# EAGLE design working (EAGLE 9.3.2)
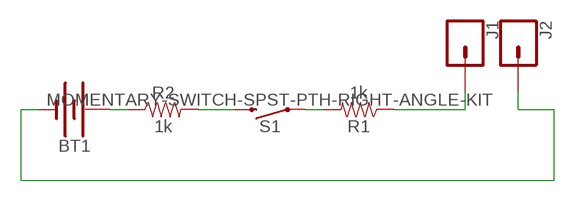
[diagram p0: schematic, sheet 1]

## Parts
BT1  BATTERY-20MM_SMD_4LEGS  [BATTCON_20MM_4LEGS]
J1  CONN_01  [1X01]
J2  CONN_01  [1X01]
R1  1k  1KOHM-HORIZ-1/4W-1%  [AXIAL-0.3]
R2  1k  1KOHM-HORIZ-1/4W-1%  [AXIAL-0.3]
S1  MOMENTARY-SWITCH-SPST-PTH-RIGHT-ANGLE-KIT  [TACTILE_SWITCH_PTH_RIGHT_ANGLE_KIT]

## Nets
N$1: R2.P$2 S1.2
N$2: R1.P$2 S1.1
N$3: J1.1 R1.P$1
N$4: BT1.NEGATIVE(-) J2.1
N$5: BT1.POSITIVE@1(+) BT1.POSITIVE@2(+) BT1.POSITIVE@3(+) BT1.POSITIVE@4(+) R2.P$1

## Library data of the parts
BT1 = SparkFun-Batteries:BATTERY: Battery - Single Cell A variety of battery chemistries, sizes, and footprints. Device List: 20MM_PTH - Coin Cell Battery Holder - 20mm (PTH) 20MM_PTH_KIT- Coin Cell battery Holder - 20 mm (PTH) kit version with special mask 6.8MM_PTH - Coin Cell Battery Holder - 6.8MM(SMD) 12MM_SMD - Coin Cell Battery Holder - 12mm (SMD) 12MM_PTH - Coin Cell Battery Holder - 12mm (PTH) 20MM_SMD - 20mm Coin Cell Battery Holder (SMD) (2 legs) Used on the Big Time Watch Kit 20MM_SMD_4LEGS - Coin Cell Battery Holder - 20mm (SMD) 20MM_SMD_4LEGS_OVERPASTE - Coin Cell Battery Holder - 20mm (SMD) (Over-paste on the legs) 24.5MM_PTH - Coin Cell Battery Holder - 24.5mm (PTH) 9V - 9V Battery Holder - PC Mount Used on the SparkFun SparkPunk Sound Kit and SparkFun SparkPunk Sequencer Kit 18650 - Battery Holder - 18650 (PTH) AA - Battery Holder - 1xAA (PTH) AAA - Battery Holder - 1xAAA (PTH) AA_KIT - Battery Holder - 1xAA (PTH) Special kit package - pads only have exposed copper on one side of the board. AAA_KIT - Battery Holder - 1xAAA (PTH) Special kit package - pads only have exposed copper on one side of the board.; PROD_ID: BATT-10373; SF_SKU: PRT-11892
J1 J2 = SparkFun-Connectors:CONN_01: Single connection point. Often used as Generic Header-pin footprint for 0.1 inch spaced/style header connections On any of the 0.1 inch spaced packages, you can populate with these: Break Away Headers - Straight (PRT-00116) Break Away Male Headers - Right Angle (PRT-00553) Female Headers (PRT-00115) Break Away Headers - Machine Pin (PRT-00117) Break Away Female Headers - Swiss Machine Pin (PRT-00743) This device is also useful as a general connection point to wire up your design to another part of your project. Our various solder wires solder well into these plated through hole pads. Hook-Up Wire - Assortment (Stranded, 22 AWG) (PRT-11375) Hook-Up Wire - Assortment (Solid Core, 22 AWG) (PRT-11367) View the entire wire category on our website here Special notes: SMTSO-256-ET is a "flush mount" nut for a 4-40 screw. We mostly use this on specialty testbeds; it is a nice way to connect hardware to your PCB at an adjustable hieght. Also note, the SNAP packages are for using a snappable style connector. We sell a baggie of snaps and they are also used on two LilyPad designs: Snap Assortment - 30 pack (male and female) (DEV-11347) LilyPad Arduino SimpleSnap (DEV-10941) LilyPad SimpleSnap Protoboard (DEV-10940)
R1 R2 = SparkFun-Resistors:1KOHM: 1kΩ resistor A resistor is a passive two-terminal electrical component that implements electrical resistance as a circuit element. Resistors act to reduce current flow, and, at the same time, act to lower voltage levels within circuits. - Wikipedia; PROD_ID: RES-12182
S1 = SparkFun-Switches:MOMENTARY-SWITCH-SPST: Momentary Switch (Pushbutton) - SPST Normally-open (NO) SPST momentary switches (buttons, pushbuttons). Variants PTH-12MM - 12mm square, through-hole Momentary Pushbutton Switch - 12mm Square (COM-09190) PTH-6.0MM, PTH-6.0MM-KIT - 6.0mm square, through-hole Mini Pushbutton Switch (COM-00097) KIT package intended for soldering kit's - only one side of pads' copper is exposed. PTH-RIGHT-ANGLE-KIT - Right-angle, through-hole Right Angle Tactile Button - Used on SparkFun BigTime Watch Kit SMD-12MM - 12mm square, surface-mount Tactile Button - SMD (12mm) (COM-12993) Used on SparkFun PicoBoard SMD-4.5MM - 4.5mm Square Trackball Switch Used on SparkFun Blackberry Trackballer Breakout SMD-4.6MMX2.8MM - 4.60mm x 2.80mm, surface mount Used on SparkFun SAMD21 Mini Breakout SMD-5.2MM, SMD-5.2-REDUNDANT - 5.2mm square, surface-mount Mini Pushbutton Switch - SMD (COM-08720) Used on Arduino Pro Mini REDUNDANT package connects both switch circuits together SMD-6.0X3.5MM - 6.0 x 3.5mm, surface mount Momentary Reset Switch SMD (COM-08229) SMD-6.2MM-TALL - 6.2mm square, surface mount Tactile Button - SMD (6mm) Used on SparkFun Digital Sandbox SMD-RIGHT-ANGLE - Right-angle, surface mount Used on SparkFun Block for Intel® Edison - Arduino; PROD_ID: CONN-10672; SF_SKU: COM-10791

## Board
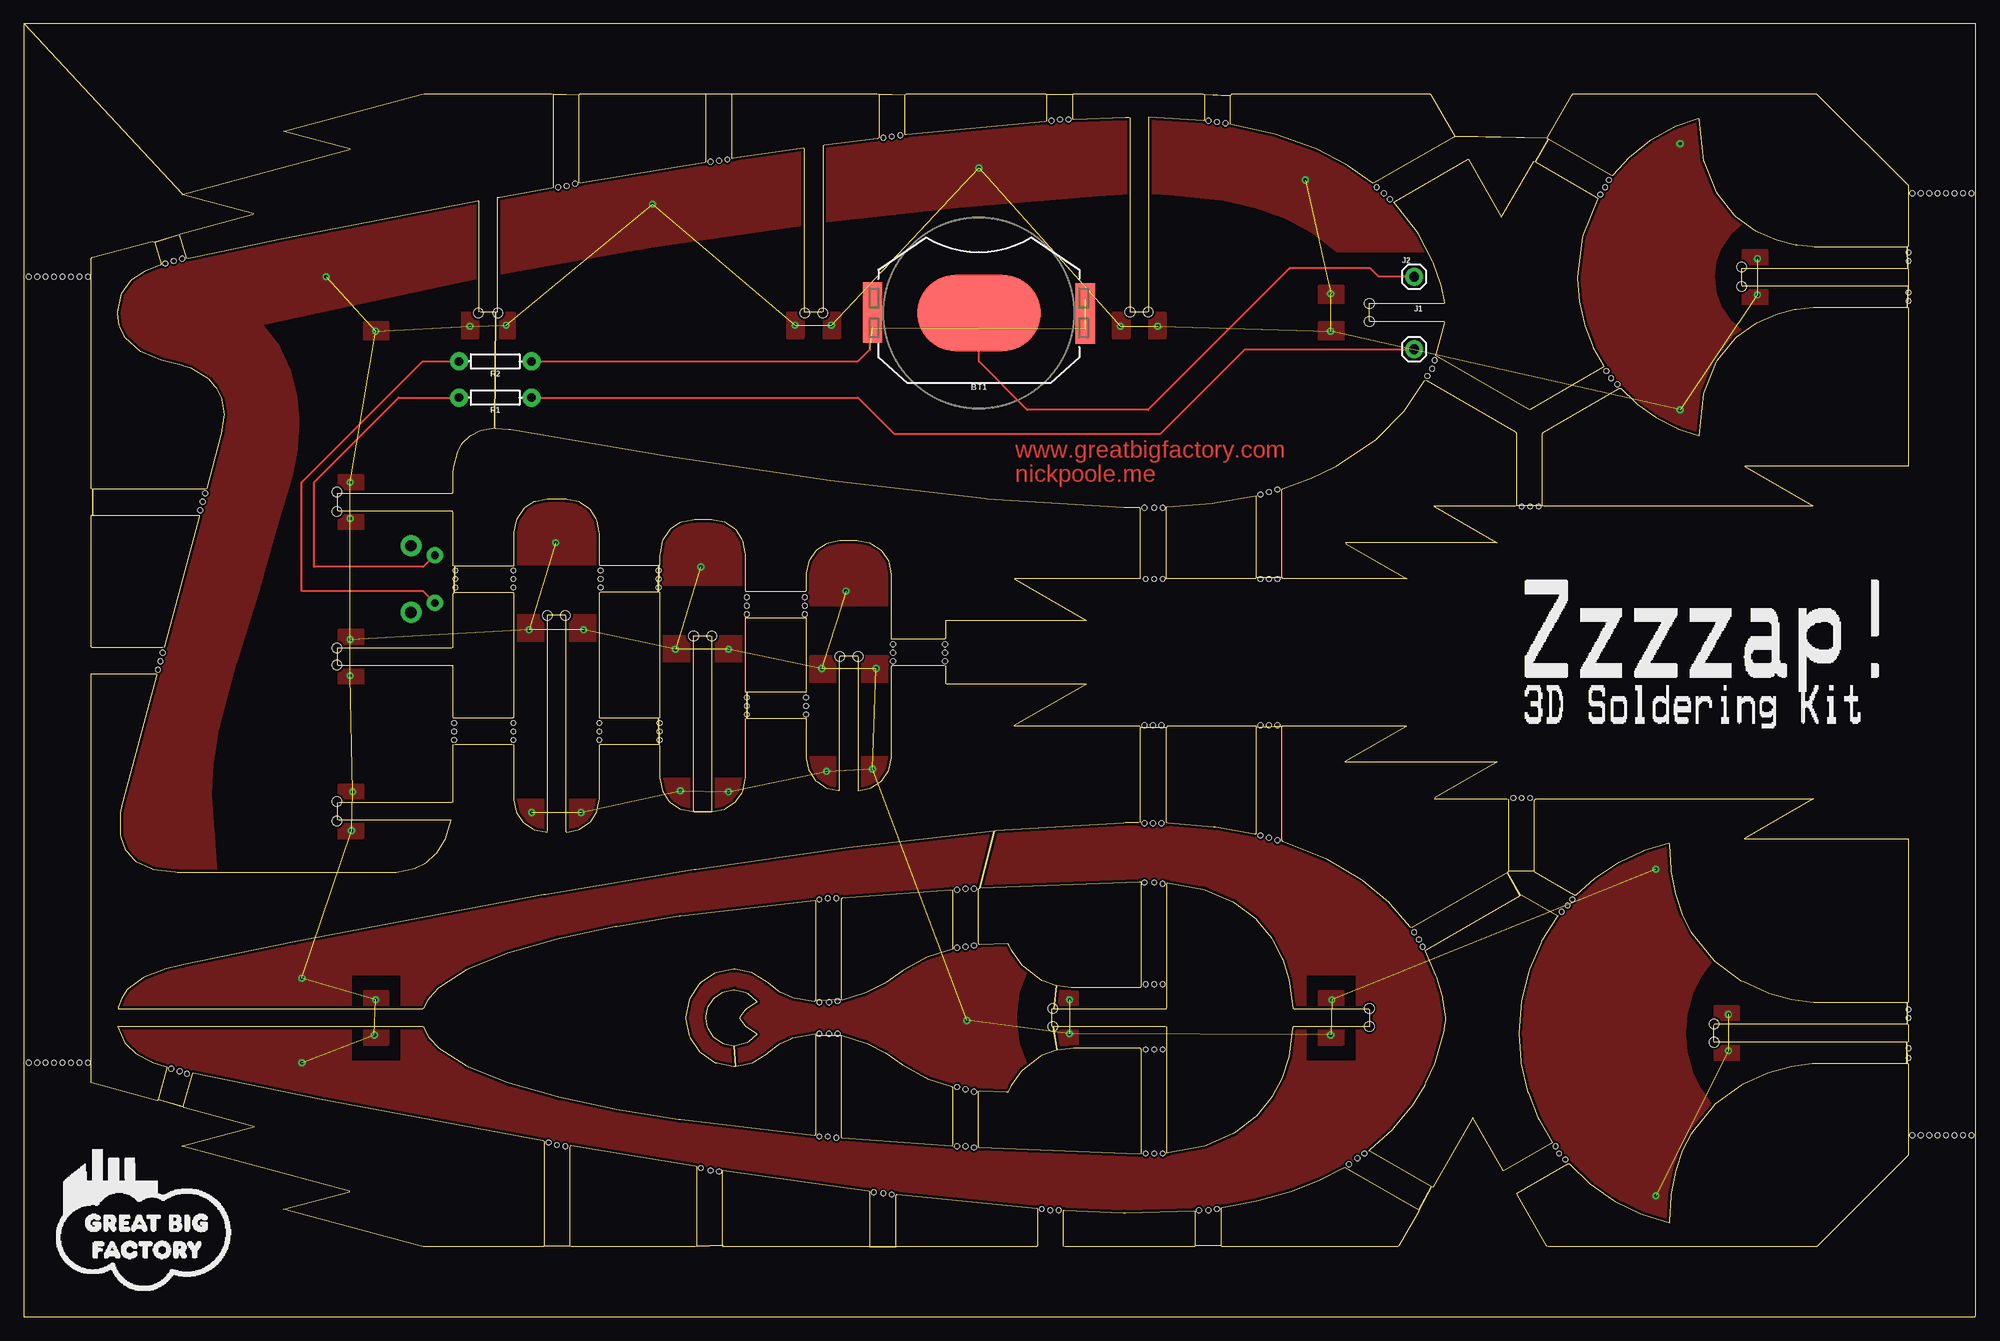
[diagram p1: board, top side]
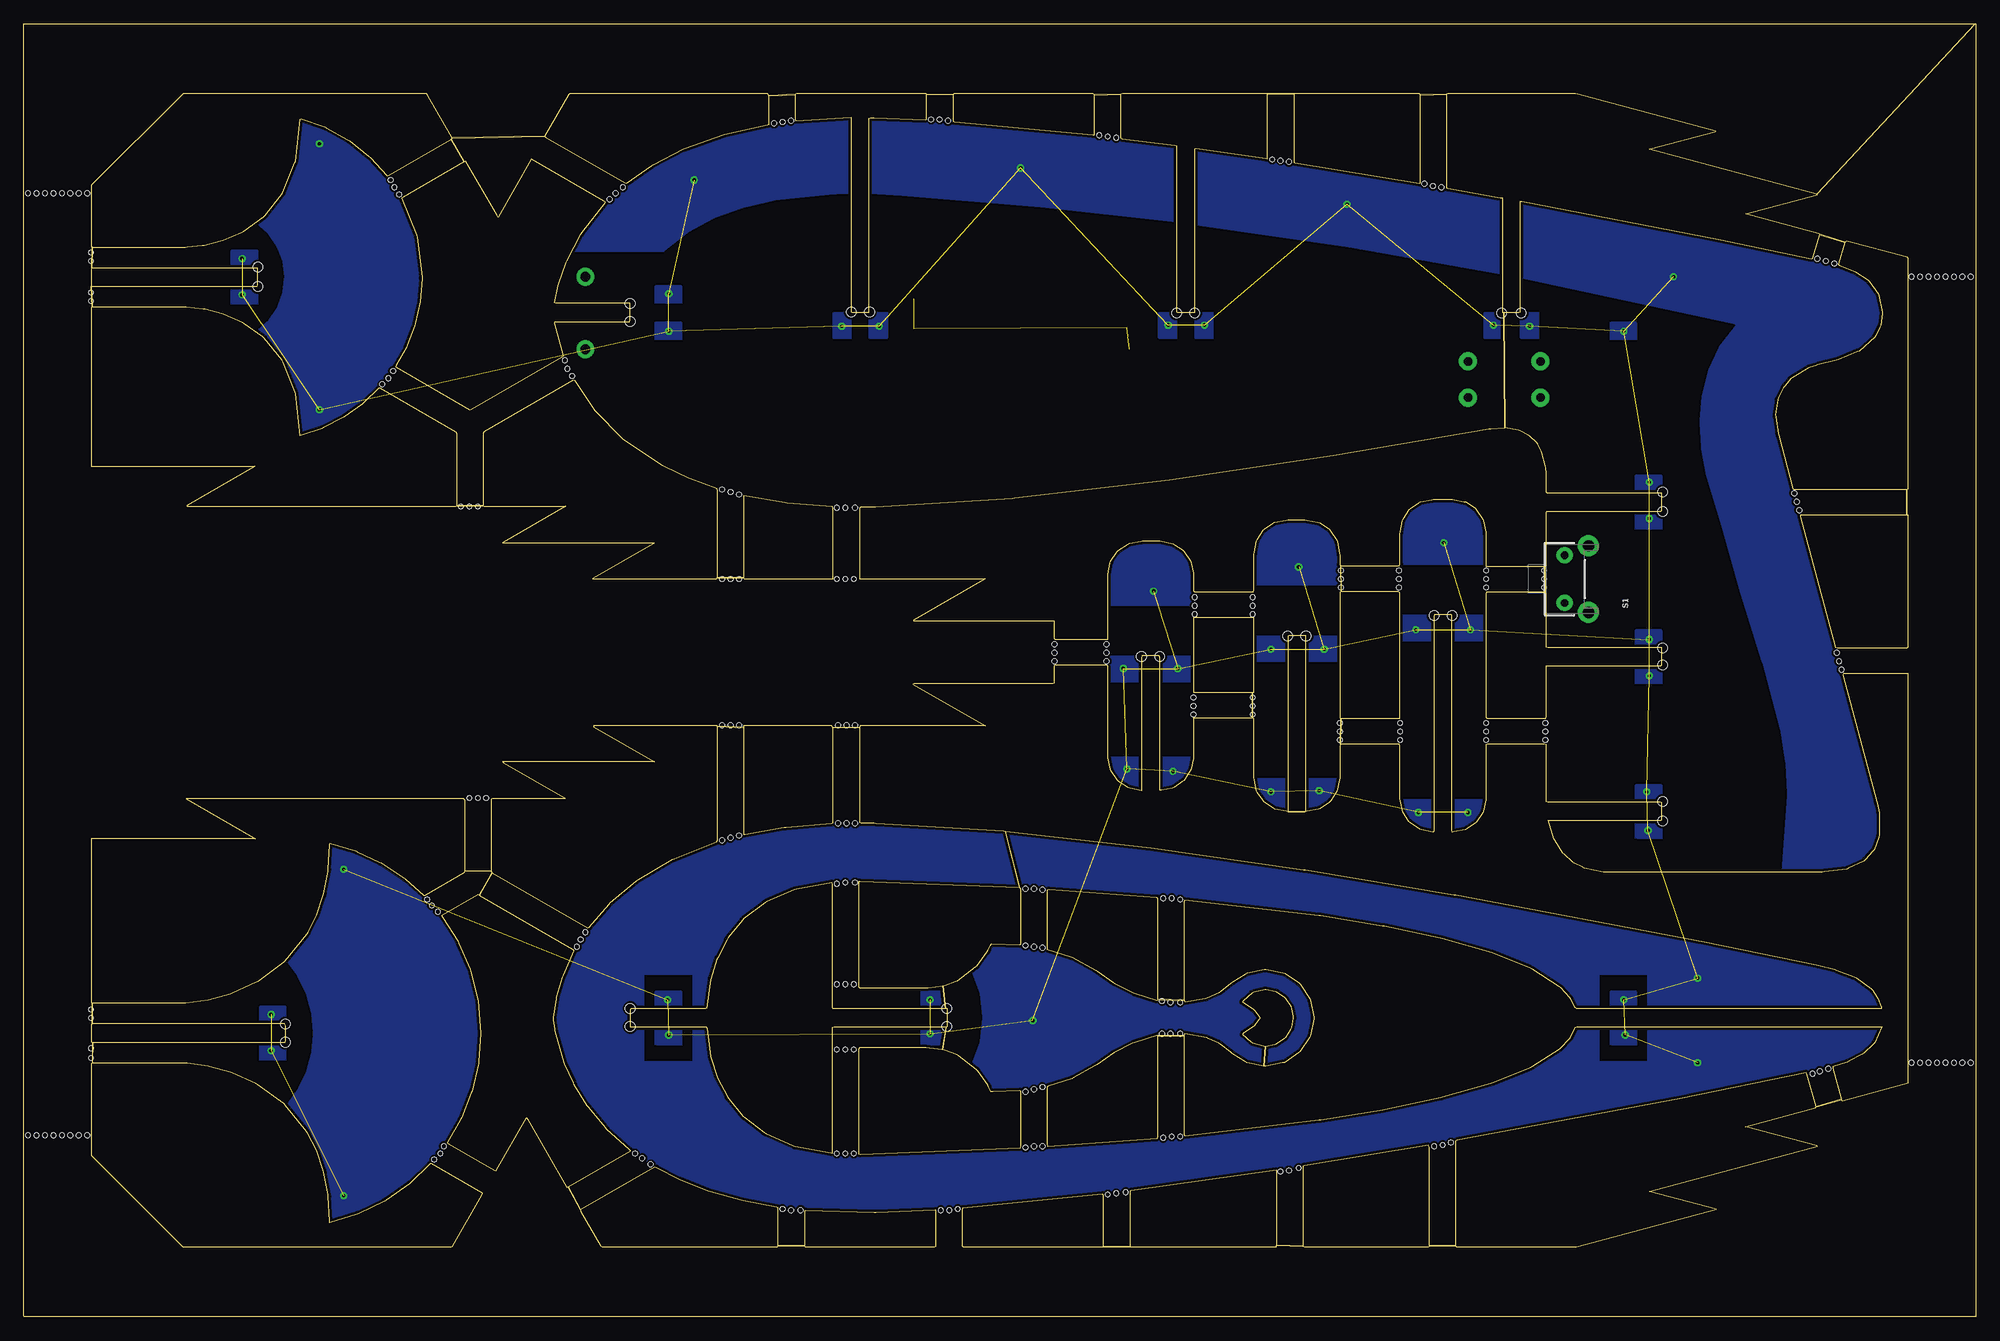
[diagram p2: board, bottom side, seen from below]

Size 205.04 x 135.78 mm. Coordinates in mm from the lower left corner, seen from the top.
Outline: 1141 segments
Copper layers (1*16): Top 0.035mm / dielectric 1.5mm / Bottom 0.035mm
Design rules "default *": minimum track width 6mil, minimum drill 0.35mm, track to track 6mil, track to pad 6mil, pad to pad 6mil, via to via 6mil, smd to smd 6mil, copper to edge 10mil, drill to drill 6mil, minimum pad ring 10mil, minimum via ring 8mil, stop-mask expansion 4mil, vias tented up to drill 0mil, thermal gap 10mil
Holes 0.51 mm at 14.86,110.62 15.75,110.87 16.64,111.13 19.05,86.49 18.8,85.6 18.54,84.71 14.61,69.72 14.35,68.83 14.1,67.95 45.34,78.36 45.34,77.47 45.34,76.58 45.21,62.36 45.21,61.47 45.21,60.58 117.73,84.96 118.75,84.96 119.63,84.96 129.92,86.36 131.7,86.87 130.81,86.61 147.45,98.81 148.21,100.46 147.96,99.57 142.11,118.62 143.51,117.35 142.88,117.98 124.46,125.6 126.24,125.35 125.35,125.48 107.95,125.6 109.73,125.73 108.84,125.73 92.08,124.08 90.3,123.83 91.19,123.95 73.91,121.54 72.14,121.29 73.03,121.41 57.91,119 56.13,118.62 57.02,118.75 51.44,78.36 51.44,77.47 51.44,76.58 51.44,62.36 51.44,61.47 51.44,60.58 60.58,78.36 60.58,77.47 60.58,76.58 66.68,78.36 66.68,77.47 66.68,76.58 60.45,62.36 60.45,61.47 60.45,60.58 66.8,62.36 66.8,61.47 66.8,60.58 75.95,75.57 75.95,74.68 75.95,73.79 82.04,75.57 82.04,74.68 82.04,73.79 75.95,65.02 75.95,64.14 75.95,63.25 82.17,65.02 82.17,64.14 82.17,63.25 91.31,70.61 91.31,69.72 91.31,68.83 96.77,70.61 96.77,69.72 96.77,68.83 117.86,77.47 118.75,77.47 119.63,77.47 129.92,77.47 130.81,77.47 131.7,77.47 157.35,85.09 158.24,85.09 159.13,85.09 117.73,62.1 118.62,62.1 119.51,62.1 129.92,62.1 130.81,62.1 131.7,62.1 156.46,54.48 157.35,54.48 158.24,54.48 165.61,117.86 166.5,119.38 166.12,118.62 167.39,97.92 166.24,99.31 166.75,98.55 197.99,110.87 197.99,111.76 197.99,107.57 197.99,106.68 197.99,32.26 197.99,31.37 197.99,28.19 197.99,27.18 162.69,43.82 161.54,42.55 162.18,43.18 160.91,17.91 161.93,16.51 161.29,17.15 117.86,28.07 118.75,28.07 119.63,28.07 146.94,38.86 146.05,40.39 146.56,39.62 140.84,17.15 139.19,16 140.08,16.64 117.86,17.15 119.63,17.15 118.75,17.15 117.73,45.59 119.63,45.47 118.75,45.59 129.92,50.55 131.7,50.04 130.81,50.29 117.73,51.82 119.51,51.82 118.62,51.82 15.49,26.04 17.15,25.53 16.38,25.78 125.35,11.3 123.44,11.18 124.46,11.18 106.93,11.3 108.71,11.18 107.82,11.18 98.04,17.91 99.82,17.78 98.93,17.91 85.34,18.8 83.57,18.92 84.46,18.92 99.82,23.62 98.04,24.13 98.93,23.88 83.57,29.72 85.47,29.72 84.58,29.72 98.04,38.74 99.82,38.99 98.93,38.86 83.57,33.02 85.47,33.15 84.58,33.02 98.04,44.83 99.82,44.96 98.93,44.96 83.57,43.82 85.34,43.94 84.46,43.94 89.28,13.08 91.19,12.83 90.3,12.95 71.12,15.62 73.03,15.24 72.14,15.37 55.12,18.29 56.9,17.91 56.01,18.03 0.51,109.22 1.4,109.22 2.29,109.22 3.18,109.22 4.06,109.22 4.95,109.22 5.84,109.22 6.73,109.22 0.51,26.67 1.4,26.67 2.29,26.67 3.18,26.67 4.06,26.67 4.95,26.67 5.84,26.67 6.73,26.67 198.37,117.98 199.26,117.98 200.15,117.98 201.04,117.98 201.93,117.98 202.82,117.98 203.71,117.98 204.6,117.98 198.37,19.05 199.26,19.05 200.15,19.05 201.04,19.05 201.93,19.05 202.82,19.05 203.71,19.05 204.6,19.05 117.86,34.93 118.75,34.93 119.63,34.93
Holes 1.02 mm at 141.35,30.48 141.35,32.39 177.55,28.83 177.55,30.73 108.08,32.39 108.08,30.48 87.63,69.34 85.73,69.34 72.26,71.5 70.36,71.5 56.9,73.66 54.99,73.66 32.89,70.23 32.89,68.45 32.89,52.07 32.89,54.1 32.89,86.61 32.89,84.58 47.75,105.41 49.78,105.41 83.95,105.41 82.04,105.41 116.21,105.54 118.11,105.54 141.35,106.43 141.35,104.52 180.47,110.24 180.47,108.2

### Footprints (pad centres in the part's own frame; a part is rotated, then mirrored left to right if it is on the bottom)
BATTCON_20MM_4LEGS = smd 13 x 8: NEGATIVE 0,0 | smd 2.032 x 3.175: POSITIVE@1 -11.176,1.651; POSITIVE@2 -11.176,-1.524; POSITIVE@3 11.176,1.524; POSITIVE@4 11.176,-1.651
1X01 = drill 1.016 pad 1.88: 1 0,0
AXIAL-0.3 = drill 0.9 pad 1.88: P$1 -3.81,0; P$2 3.81,0
TACTILE_SWITCH_PTH_RIGHT_ANGLE_KIT = drill 0.8 pad 1.7: 1 -2.5,0; 2 2.5,0 | drill 1.2 pad 2.2: ANCHOR1 -3.5,2.5; ANCHOR2 3.5,2.5

### Placement (x,y rotation side)
BT1  100.33,105.41 180 top
E$1  [GREATBIGFACTORYCLOUDLOGO#PNG]  12.7,10.16 0 top
J1  146.05,101.6 0 top
J2  146.05,109.22 0 top
R1  49.53,96.52 180 top
R2  49.53,100.33 180 top
S1  43.18,77.47 270 bottom
U$1  [TEXT345#PNG]  180.34,69.85 0 top

### Tracks (layer width: path | path; a pad name or v marks a point on that pad's centre or on a via)
GND  (via drill 0.35)  (48 unrouted)
  other vias: 34.54,55.12 34.42,51.05 34.29,71.12 34.29,67.31 34.29,87.63 34.29,83.82 46.86,104.01 50.67,104.14 81.03,104.14 84.84,104.14 115.19,104.01 119.13,104.01 137.29,107.44 137.29,103.51 36.96,33.27 36.83,29.59 109.86,33.27 109.86,29.72 137.41,33.27 137.29,29.59 179.07,31.75 179.07,27.94 182.12,111.13 182.12,107.32 53.09,72.14 58.8,72.14 68.45,70.1 74.04,70.1 83.82,68.07 89.54,68.07 31.75,109.22 66.04,116.84 100.33,120.65 134.62,119.38 29.21,35.56 29.21,26.67 99.06,31.12 173.99,123.19 173.99,95.25 171.45,46.99 171.45,12.7 55.88,81.28 71.12,78.74 86.36,76.2 53.34,52.96 58.55,52.96 68.96,55.25 74.04,55.12 84.33,57.28 89.15,57.53 36.96,103.51
  pour Top (rank 3): 172.9,49.76 169.66,48.72 169.48,48.63 166.65,47.15 166.48,47.04 163.92,45.12 163.78,44.98 161.58,42.66 161.46,42.5 159.66,39.85 159.58,39.67 158.25,36.76 158.19,36.56 157.37,33.47 157.34,33.27 157.04,29.89 157.04,29.69 157.34,26.3 157.38,26.11 158.2,23.01 158.26,22.82 159.59,19.91 159.68,19.73 161.48,17.08 161.59,16.92 163.8,14.61 163.95,14.47 166.5,12.54 166.67,12.44 169.51,10.96 169.69,10.88 172.74,9.9 172.9,9.87 173.25,13.86 173.29,14.05 174.18,17.13 174.24,17.32 175.65,19.96 175.78,20.12 177.45,22.11 177.37,22.27 176.31,23.73 176.2,23.9 175.34,25.7 175.28,25.89 174.8,27.62 174.77,27.82 174.6,29.61 174.59,29.81 174.77,31.8 174.8,32 175.28,33.73 175.34,33.93 176.21,35.73 176.32,35.9 177.38,37.35 177.43,37.51 175.76,39.5 175.64,39.66 174.23,42.31 173.28,45.58 173.25,45.77 172.9,49.76
  pour Top (rank 3): 175.99,125.85 173.36,124.91 173.18,124.82 170.91,123.55 170.75,123.43 168.71,121.82 166.95,119.9 166.82,119.75 165.39,117.58 165.29,117.41 164.23,115.03 164.16,114.85 163.46,112.14 163.43,111.94 163.22,109.35 163.2,109.15 163.44,106.36 163.47,106.16 164.12,103.65 164.17,103.45 165.23,101.08 165.31,100.9 166.74,98.72 166.85,98.56 168.61,96.64 168.75,96.5 170.79,94.89 170.95,94.77 173.23,93.51 173.41,93.43 175.85,92.55 175.99,92.56 176.36,96.34 176.41,96.53 177.35,99.38 177.45,99.56 178.84,101.75 178.98,101.89 180.57,103.42 180.52,103.55 179.47,104.48 179.32,104.62 178.41,105.93 178.34,106.12 177.84,107.43 177.8,107.62 177.62,109.01 177.61,109.21 177.8,110.8 177.86,110.99 178.36,112.29 178.45,112.47 179.25,113.62 179.37,113.78 180.57,114.84 180.52,114.97 178.94,116.5 178.81,116.65 177.42,118.84 177.34,119.03 176.4,121.87 176.36,122.07 175.99,125.85
  pour Top (rank 3): 103.11,39.19 98.72,38.83 98.52,38.79 95.62,38.03 95.43,37.97 92.42,36.39 92.25,36.28 89.92,34.72 89.74,34.64 87.35,33.61 87.16,33.55 84,33.04 82,33.21 81.81,33.24 80.09,33.77 79.91,33.85 78.27,35 78.1,35.11 76.59,36.09 76.4,36.14 74.63,36.49 74.44,36.45 72.67,36.1 72.5,36 71.17,35.1 71.01,34.99 70,33.49 69.91,33.32 69.55,31.55 69.53,31.36 69.88,29.59 69.93,29.4 70.93,27.9 71.06,27.75 72.55,26.74 72.73,26.67 74.5,26.31 74.7,26.3 76.46,26.65 76.64,26.72 78.16,27.7 79.79,28.85 79.96,28.96 81.87,29.56 83.86,29.73 84.06,29.73 87.22,29.22 87.41,29.14 89.8,28.11 89.98,28.02 92.3,26.46 92.47,26.35 94.01,25.42 94.19,25.33 95.86,24.65 96.05,24.6 99.37,23.85 99.57,23.82 103.37,23.6 103.48,23.74 103.85,24.45 103.96,24.62 105.35,26.32 105.42,26.49 104.59,28.74 104.54,28.93 104.26,31.32 104.27,31.52 104.55,33.9 104.62,34.09 105.38,36.16 105.44,36.34 103.92,38.2 103.82,38.38 103.45,39.09 103.31,39.18 103.11,39.19
  pour Top (rank 3): 118.15,125.95 118.15,117.95 118.34,117.93 119.74,117.89 119.94,117.88 126.11,117.23 126.3,117.2 129.42,116.47 129.61,116.4 132.43,115.39 132.62,115.32 135.27,113.91 135.44,113.81 137.78,111.93 137.91,111.78 139.6,109.55 139.71,109.38 140.78,106.58 140.87,106.42 141.47,106.42 149.27,106.42 149.26,106.6 148.88,108.36 148.81,108.55 147.94,110.99 147.86,111.18 146.22,114.16 146.11,114.33 143.43,117.56 143.27,117.69 139.51,120.66 139.34,120.77 137.07,122.04 136.89,122.13 134.14,123.32 133.95,123.38 130.9,124.35 130.7,124.4 127.18,125.16 126.99,125.2 123.02,125.7 122.82,125.73 118.23,125.95
  pour Top (rank 3): 116.12,125.94 115.72,125.94 115.52,125.93 100.95,124.99 100.75,124.97 84.06,123.01 83.95,122.91 83.95,115.11 83.96,114.92 98.67,116.58 98.87,116.59 113.42,117.77 113.62,117.78 116.22,117.92 116.24,118.09 116.24,125.9
  pour Top (rank 3): 81.89,122.71 65.67,120.25 65.47,120.21 49.9,117.53 49.74,117.47 49.74,109.46 49.91,109.46 65.86,112.29 81.89,114.65 82.04,114.73 82.04,122.73
  pour Top (rank 3): 47.65,117.12 26.24,113.01 16.64,111 14.7,110.52 14.51,110.47 12.47,109.64 12.29,109.56 10.64,108.1 10.51,107.95 10.08,107.05 10,106.87 9.78,105.48 9.81,105.29 9.99,104.1 10.07,103.92 10.5,103.02 10.62,102.86 12.27,101.4 12.44,101.31 14.48,100.48 14.67,100.43 16.62,99.95 16.81,99.89 17.38,99.7 17.56,99.63 19.28,98.61 19.42,98.46 20.09,97.72 20.2,97.56 20.73,96.48 20.8,96.29 21,94.91 21.03,94.71 20.74,92.73 20.7,92.54 10.4,54.08 10.13,52.92 10.13,52.72 10.15,50.52 10.18,50.32 10.61,49.2 10.68,49.01 11.62,47.97 11.76,47.83 13.39,47.06 13.58,47.01 15.96,46.72 16.16,46.7 20.16,46.7 20.34,46.72 19.72,54.7 19.72,54.9 19.9,58.09 19.93,58.29 20.45,61.45 20.48,61.65 22.34,68.61 22.39,68.8 24.64,75.85 24.69,76.04 26.61,82.99 28.2,88.15 28.26,88.34 28.74,91.1 28.76,91.29 28.93,93.89 28.92,94.09 28.73,96.68 28.69,96.88 28.11,99.21 28.06,99.4 26.95,101.75 26.86,101.93 25.15,104.15 25.24,104.22 47.73,109.04 47.84,109.16 47.84,117.16
  pour Top (rank 3): 250 corners
  pour Top (rank 3): 85.71,81.47 85.03,81.4 84.97,81.39 84.37,81.21 84.32,81.19 83.76,80.89 83.71,80.86 83.22,80.45 83.19,80.42 82.78,79.93 82.75,79.88 82.45,79.33 82.43,79.28 82.24,78.67 82.23,78.62 82.16,77.93 82.16,74.7 82.2,74.69 91.14,74.69 91.16,74.72 91.16,77.9 91.16,77.95 91.09,78.63 91.08,78.68 90.89,79.29 90.87,79.34 90.57,79.9 90.54,79.94 90.13,80.43 90.09,80.46 89.6,80.87 89,81.2 88.34,81.4 87.65,81.47 87.6,81.47 85.75,81.47
  pour Top (rank 3): 82.17,58.78 82.23,58.1 82.25,58.05 82.43,57.44 82.45,57.39 82.76,56.83 82.79,56.79 83.19,56.3 83.23,56.26 83.72,55.86 83.77,55.83 84.32,55.53 84.98,55.33 85.03,55.32 85.67,55.25 85.71,55.26 85.71,58.75 85.7,58.8 82.21,58.8
  pour Top (rank 3): 87.62,58.79 87.62,55.3 87.62,55.25 88.31,55.32 88.36,55.33 88.97,55.52 89.02,55.54 89.58,55.84 89.62,55.87 90.11,56.27 90.15,56.31 90.55,56.8 90.58,56.84 90.88,57.4 90.9,57.45 91.09,58.06 91.1,58.11 91.16,58.8 87.62,58.8
  pour Top (rank 3): 69.61,83.61 68.96,83.4 68.4,83.1 68.35,83.08 67.86,82.67 67.82,82.63 67.42,82.14 67.39,82.1 67.09,81.54 66.89,80.88 66.88,80.83 66.82,80.2 66.81,80.15 66.81,76.87 66.83,76.83 75.77,76.83 75.81,76.84 75.81,80.17 75.75,80.86 75.73,80.91 75.55,81.51 75.53,81.56 75.22,82.12 75.19,82.16 74.79,82.65 74.3,83.06 74.26,83.09 73.7,83.39 73.65,83.41 73.04,83.6 72.99,83.61 72.31,83.68 70.35,83.68 70.3,83.68
  pour Top (rank 3): 66.89,55.84 67.09,55.19 67.39,54.63 67.42,54.58 67.82,54.09 67.86,54.06 68.34,53.65 68.39,53.62 68.95,53.32 69,53.3 69.6,53.12 69.65,53.11 70.34,53.04 70.34,53.09 70.36,56.53 70.33,56.55 66.84,56.55 66.82,56.53
  pour Top (rank 3): 73.01,53.11 73.67,53.32 74.23,53.62 74.28,53.65 74.76,54.05 74.8,54.09 75.21,54.57 75.23,54.62 75.54,55.18 75.55,55.23 75.74,55.83 75.75,55.89 75.81,56.52 75.8,56.55 72.31,56.55 72.27,56.54 72.29,53.05 72.33,53.05
  pour Top (rank 3): 54.24,85.77 53.58,85.57 53.02,85.26 52.98,85.24 52.49,84.83 52.45,84.79 52.08,84.34 52.05,84.3 51.75,83.74 51.73,83.7 51.54,83.09 51.53,83.04 51.47,82.41 51.46,82.35 51.46,79.02 51.49,78.99 60.43,78.99 60.46,79.01 60.46,82.34 60.46,82.4 60.4,83.03 60.39,83.08 60.2,83.69 60.18,83.74 59.88,84.29 59.85,84.34 59.45,84.83 58.96,85.23 58.91,85.26 58.36,85.56 58.31,85.58 57.7,85.77 57.65,85.78 57.02,85.84 56.96,85.84 54.95,85.84 54.9,85.84 54.27,85.77
  pour Top (rank 3): 51.54,53.63 51.73,53.03 51.75,52.98 52.05,52.42 52.08,52.38 52.45,51.93 52.49,51.89 52.98,51.49 53.02,51.46 53.58,51.16 54.24,50.95 54.92,50.88 54.97,50.88 55.01,50.9 55.01,54.33 54.98,54.36 51.49,54.36 51.47,54.33 51.53,53.7
  pour Top (rank 3): 56.93,50.88 56.98,50.88 57.03,50.88 57.66,50.95 57.72,50.96 58.32,51.15 58.37,51.17 58.93,51.47 58.97,51.5 59.42,51.87 59.46,51.91 59.86,52.4 59.89,52.44 60.19,53 60.39,53.66 60.46,54.34 60.42,54.36 56.93,54.36 56.92,54.32 56.92,50.88
  pour Top (rank 3): 51.46,73.7 51.46,71.09 51.5,70.93 54.91,70.93 55.01,71.03 55.01,73.64 54.87,73.7
  pour Top (rank 3): 56.92,73.7 56.92,71.09 56.95,70.93 60.36,70.93 60.46,71.03 60.46,73.64 60.33,73.7
  pour Top (rank 3): 66.81,71.54 66.81,68.93 66.85,68.77 70.26,68.77 70.36,68.87 70.36,71.47 70.22,71.54
  pour Top (rank 3): 72.27,71.54 72.27,68.93 72.3,68.77 75.71,68.77 75.81,68.87 75.81,71.47 75.68,71.54
  pour Top (rank 3): 82.16,69.39 82.16,66.79 82.2,66.62 85.61,66.62 85.71,66.72 85.71,69.33 85.57,69.39
  pour Top (rank 3): 87.62,69.39 87.62,66.79 87.65,66.62 91.06,66.62 91.16,66.72 91.16,69.33 91.03,69.39
  pour Top (rank 3): 32.97,86.5 35.56,86.5 35.75,86.52 35.75,88.31 35.65,88.41 33.06,88.41 32.97,88.3
  pour Top (rank 3): 32.97,82.69 35.56,82.69 35.75,82.7 35.75,84.5 35.65,84.6 33.06,84.6 32.97,84.48
  pour Top (rank 3): 32.97,66.45 35.56,66.45 35.75,66.47 35.75,68.26 35.65,68.36 33.06,68.36 32.97,68.24
  pour Top (rank 3): 32.97,70.27 35.56,70.27 35.75,70.28 35.75,72.08 35.65,72.18 33.06,72.18 32.97,72.06
  pour Top (rank 3): 32.97,54.03 35.56,54.03 35.75,54.05 35.75,55.84 35.65,55.94 33.06,55.94 32.97,55.82
  pour Top (rank 3): 32.97,50.21 35.56,50.21 35.75,50.23 35.75,52.02 35.65,52.12 33.06,52.12 32.97,52.01
  pour Top (rank 3): 35.63,32.34 38.22,32.34 38.4,32.36 38.4,34.15 38.3,34.25 35.71,34.25 35.63,34.13
  pour Top (rank 3): 35.63,28.53 38.22,28.53 38.4,28.54 38.4,30.34 38.3,30.44 35.71,30.44 35.63,30.32
  pour Top (rank 3): 135.94,32.34 138.53,32.34 138.71,32.36 138.71,34.15 138.61,34.25 136.02,34.25 135.94,34.13
  pour Top (rank 3): 135.94,28.53 138.53,28.53 138.71,28.54 138.71,30.34 138.61,30.44 136.02,30.44 135.94,30.32
  pour Top (rank 3): 180.47,110.13 183.05,110.13 183.24,110.15 183.24,111.94 183.14,112.04 180.55,112.04 180.47,111.92
  pour Top (rank 3): 180.47,106.31 183.05,106.31 183.24,106.33 183.24,108.12 183.14,108.22 180.55,108.22 180.47,108.1
  pour Top (rank 3): 177.51,30.75 180.1,30.75 180.28,30.77 180.28,32.56 180.18,32.66 177.6,32.66 177.51,32.55
  pour Top (rank 3): 177.51,26.94 180.1,26.94 180.28,26.96 180.28,28.75 180.18,28.85 177.6,28.85 177.51,28.73
  pour Top (rank 3): 108.02,32.34 110.61,32.34 110.79,32.36 110.79,34.15 110.69,34.25 108.1,34.25 108.02,34.13
  pour Top (rank 3): 108.02,28.53 110.61,28.53 110.79,28.54 110.79,30.34 110.69,30.44 108.1,30.44 108.02,30.32
  pour Top (rank 3): 118.15,105.47 118.15,102.88 118.17,102.7 119.96,102.7 120.06,102.8 120.06,105.39 119.94,105.47
  pour Top (rank 3): 114.33,105.47 114.33,102.88 114.35,102.7 116.14,102.7 116.24,102.8 116.24,105.39 116.13,105.47
  pour Top (rank 3): 83.95,105.47 83.95,102.88 83.96,102.7 85.76,102.7 85.86,102.8 85.86,105.39 85.74,105.47
  pour Top (rank 3): 80.13,105.47 80.13,102.88 80.15,102.7 81.94,102.7 82.04,102.8 82.04,105.39 81.92,105.47
  pour Top (rank 3): 45.93,105.47 45.93,102.88 45.94,102.7 47.74,102.7 47.84,102.8 47.84,105.39 47.72,105.47
  pour Top (rank 3): 49.74,105.47 49.74,102.88 49.76,102.7 51.55,102.7 51.65,102.8 51.65,105.39 51.54,105.47
  pour Top (rank 3): 135.94,102.61 138.53,102.61 138.71,102.63 138.71,104.42 138.61,104.52 136.02,104.52 135.94,104.4
  pour Top (rank 3): 35.63,102.61 38.22,102.61 38.4,102.63 38.4,104.42 38.3,104.52 35.71,104.52 35.63,104.4
  pour Top (rank 3): 135.94,106.42 138.53,106.42 138.71,106.44 138.71,108.23 138.61,108.33 136.02,108.33 135.94,108.22
  pour Bottom (rank 3): 172.9,49.76 169.66,48.72 169.48,48.63 166.65,47.15 166.48,47.04 163.92,45.12 163.78,44.98 161.58,42.66 161.46,42.5 159.66,39.85 159.58,39.67 158.25,36.76 158.19,36.56 157.37,33.47 157.34,33.27 157.04,29.89 157.04,29.69 157.34,26.3 157.38,26.11 158.2,23.01 158.26,22.82 159.59,19.91 159.68,19.73 161.48,17.08 161.59,16.92 163.8,14.61 163.95,14.47 166.5,12.54 166.67,12.44 169.51,10.96 169.69,10.88 172.74,9.9 172.9,9.87 173.25,13.86 173.29,14.05 174.18,17.13 174.24,17.32 175.65,19.96 175.78,20.12 177.45,22.11 177.37,22.27 176.31,23.73 176.2,23.9 175.34,25.7 175.28,25.89 174.8,27.62 174.77,27.82 174.6,29.61 174.59,29.81 174.77,31.8 174.8,32 175.28,33.73 175.34,33.93 176.21,35.73 176.32,35.9 177.38,37.35 177.43,37.51 175.76,39.5 175.64,39.66 174.23,42.31 173.28,45.58 173.25,45.77 172.9,49.76
  pour Bottom (rank 3): 175.99,125.85 173.36,124.91 173.18,124.82 170.91,123.55 170.75,123.43 168.71,121.82 166.95,119.9 166.82,119.75 165.39,117.58 165.29,117.41 164.23,115.03 164.16,114.85 163.46,112.14 163.43,111.94 163.22,109.35 163.2,109.15 163.44,106.36 163.47,106.16 164.12,103.65 164.17,103.45 165.23,101.08 165.31,100.9 166.74,98.72 166.85,98.56 168.61,96.64 168.75,96.5 170.79,94.89 170.95,94.77 173.23,93.51 173.41,93.43 175.85,92.55 175.99,92.56 176.36,96.34 176.41,96.53 177.35,99.38 177.45,99.56 178.84,101.75 178.98,101.89 180.57,103.42 180.52,103.55 179.47,104.48 179.32,104.62 178.41,105.93 178.34,106.12 177.84,107.43 177.8,107.62 177.62,109.01 177.61,109.21 177.8,110.8 177.86,110.99 178.36,112.29 178.45,112.47 179.25,113.62 179.37,113.78 180.57,114.84 180.52,114.97 178.94,116.5 178.81,116.65 177.42,118.84 177.34,119.03 176.4,121.87 176.36,122.07 175.99,125.85
  pour Bottom (rank 3): 103.11,39.19 98.72,38.83 98.52,38.79 95.62,38.03 95.43,37.97 92.42,36.39 92.25,36.28 89.92,34.72 89.74,34.64 87.35,33.61 87.16,33.55 84,33.04 82,33.21 81.81,33.24 80.09,33.77 79.91,33.85 78.27,35 78.1,35.11 76.59,36.09 76.4,36.14 74.63,36.49 74.44,36.45 72.67,36.1 72.5,36 71.17,35.1 71.01,34.99 70,33.49 69.91,33.32 69.55,31.55 69.53,31.36 69.88,29.59 69.93,29.4 70.93,27.9 71.06,27.75 72.55,26.74 72.73,26.67 74.5,26.31 74.7,26.3 76.46,26.65 76.64,26.72 78.16,27.7 79.79,28.85 79.96,28.96 81.87,29.56 83.86,29.73 84.06,29.73 87.22,29.22 87.41,29.14 89.8,28.11 89.98,28.02 92.3,26.46 92.47,26.35 94.01,25.42 94.19,25.33 95.86,24.65 96.05,24.6 99.37,23.85 99.57,23.82 103.37,23.6 103.48,23.74 103.85,24.45 103.96,24.62 105.35,26.32 105.42,26.49 104.59,28.74 104.54,28.93 104.26,31.32 104.27,31.52 104.55,33.9 104.62,34.09 105.38,36.16 105.44,36.34 103.92,38.2 103.82,38.38 103.45,39.09 103.31,39.18 103.11,39.19
  pour Bottom (rank 3): 118.15,125.95 118.15,117.95 118.34,117.93 119.74,117.89 119.94,117.88 126.11,117.23 126.3,117.2 129.42,116.47 129.61,116.4 132.43,115.39 132.62,115.32 135.27,113.91 135.44,113.81 137.78,111.93 137.91,111.78 139.6,109.55 139.71,109.38 140.78,106.58 140.87,106.42 141.47,106.42 149.27,106.42 149.26,106.6 148.88,108.36 148.81,108.55 147.94,110.99 147.86,111.18 146.22,114.16 146.11,114.33 143.43,117.56 143.27,117.69 139.51,120.66 139.34,120.77 137.07,122.04 136.89,122.13 134.14,123.32 133.95,123.38 130.9,124.35 130.7,124.4 127.18,125.16 126.99,125.2 123.02,125.7 122.82,125.73 118.23,125.95
  pour Bottom (rank 3): 116.12,125.94 115.72,125.94 115.52,125.93 100.95,124.99 100.75,124.97 84.06,123.01 83.95,122.91 83.95,115.11 83.96,114.92 98.67,116.58 98.87,116.59 113.42,117.77 113.62,117.78 116.22,117.92 116.24,118.09 116.24,125.9
  pour Bottom (rank 3): 81.89,122.71 65.67,120.25 65.47,120.21 49.9,117.53 49.74,117.47 49.74,109.46 49.91,109.46 65.86,112.29 81.89,114.65 82.04,114.73 82.04,122.73
  pour Bottom (rank 3): 47.65,117.12 26.24,113.01 16.64,111 14.7,110.52 14.51,110.47 12.47,109.64 12.29,109.56 10.64,108.1 10.51,107.95 10.08,107.05 10,106.87 9.78,105.48 9.81,105.29 9.99,104.1 10.07,103.92 10.5,103.02 10.62,102.86 12.27,101.4 12.44,101.31 14.48,100.48 14.67,100.43 16.62,99.95 16.81,99.89 17.38,99.7 17.56,99.63 19.28,98.61 19.42,98.46 20.09,97.72 20.2,97.56 20.73,96.48 20.8,96.29 21,94.91 21.03,94.71 20.74,92.73 20.7,92.54 10.4,54.08 10.13,52.92 10.13,52.72 10.15,50.52 10.18,50.32 10.61,49.2 10.68,49.01 11.62,47.97 11.76,47.83 13.39,47.06 13.58,47.01 15.96,46.72 16.16,46.7 20.16,46.7 20.34,46.72 19.72,54.7 19.72,54.9 19.9,58.09 19.93,58.29 20.45,61.45 20.48,61.65 22.34,68.61 22.39,68.8 24.64,75.85 24.69,76.04 26.61,82.99 28.2,88.15 28.26,88.34 28.74,91.1 28.76,91.29 28.93,93.89 28.92,94.09 28.73,96.68 28.69,96.88 28.11,99.21 28.06,99.4 26.95,101.75 26.86,101.93 25.15,104.15 25.24,104.22 47.73,109.04 47.84,109.16 47.84,117.16
  pour Bottom (rank 3): 250 corners
  pour Bottom (rank 3): 85.71,81.47 85.03,81.4 84.97,81.39 84.37,81.21 84.32,81.19 83.76,80.89 83.71,80.86 83.22,80.45 83.19,80.42 82.78,79.93 82.75,79.88 82.45,79.33 82.43,79.28 82.24,78.67 82.23,78.62 82.16,77.93 82.16,74.7 82.2,74.69 91.14,74.69 91.16,74.72 91.16,77.9 91.16,77.95 91.09,78.63 91.08,78.68 90.89,79.29 90.87,79.34 90.57,79.9 90.54,79.94 90.13,80.43 90.09,80.46 89.6,80.87 89,81.2 88.34,81.4 87.65,81.47 87.6,81.47 85.75,81.47
  pour Bottom (rank 3): 82.17,58.78 82.23,58.1 82.25,58.05 82.43,57.44 82.45,57.39 82.76,56.83 82.79,56.79 83.19,56.3 83.23,56.26 83.72,55.86 83.77,55.83 84.32,55.53 84.98,55.33 85.03,55.32 85.67,55.25 85.71,55.26 85.71,58.75 85.7,58.8 82.21,58.8
  pour Bottom (rank 3): 87.62,58.79 87.62,55.3 87.62,55.25 88.31,55.32 88.36,55.33 88.97,55.52 89.02,55.54 89.58,55.84 89.62,55.87 90.11,56.27 90.15,56.31 90.55,56.8 90.58,56.84 90.88,57.4 90.9,57.45 91.09,58.06 91.1,58.11 91.16,58.8 87.62,58.8
  pour Bottom (rank 3): 69.61,83.61 68.96,83.4 68.4,83.1 68.35,83.08 67.86,82.67 67.82,82.63 67.42,82.14 67.39,82.1 67.09,81.54 66.89,80.88 66.88,80.83 66.82,80.2 66.81,80.15 66.81,76.87 66.83,76.83 75.77,76.83 75.81,76.84 75.81,80.17 75.75,80.86 75.73,80.91 75.55,81.51 75.53,81.56 75.22,82.12 75.19,82.16 74.79,82.65 74.3,83.06 74.26,83.09 73.7,83.39 73.65,83.41 73.04,83.6 72.99,83.61 72.31,83.68 70.35,83.68 70.3,83.68
  pour Bottom (rank 3): 66.89,55.84 67.09,55.19 67.39,54.63 67.42,54.58 67.82,54.09 67.86,54.06 68.34,53.65 68.39,53.62 68.95,53.32 69,53.3 69.6,53.12 69.65,53.11 70.34,53.04 70.34,53.09 70.36,56.53 70.33,56.55 66.84,56.55 66.82,56.53
  pour Bottom (rank 3): 73.01,53.11 73.67,53.32 74.23,53.62 74.28,53.65 74.76,54.05 74.8,54.09 75.21,54.57 75.23,54.62 75.54,55.18 75.55,55.23 75.74,55.83 75.75,55.89 75.81,56.52 75.8,56.55 72.31,56.55 72.27,56.54 72.29,53.05 72.33,53.05
  pour Bottom (rank 3): 54.24,85.77 53.58,85.57 53.02,85.26 52.98,85.24 52.49,84.83 52.45,84.79 52.08,84.34 52.05,84.3 51.75,83.74 51.73,83.7 51.54,83.09 51.53,83.04 51.47,82.41 51.46,82.35 51.46,79.02 51.49,78.99 60.43,78.99 60.46,79.01 60.46,82.34 60.46,82.4 60.4,83.03 60.39,83.08 60.2,83.69 60.18,83.74 59.88,84.29 59.85,84.34 59.45,84.83 58.96,85.23 58.91,85.26 58.36,85.56 58.31,85.58 57.7,85.77 57.65,85.78 57.02,85.84 56.96,85.84 54.95,85.84 54.9,85.84 54.27,85.77
  pour Bottom (rank 3): 51.54,53.63 51.73,53.03 51.75,52.98 52.05,52.42 52.08,52.38 52.45,51.93 52.49,51.89 52.98,51.49 53.02,51.46 53.58,51.16 54.24,50.95 54.92,50.88 54.97,50.88 55.01,50.9 55.01,54.33 54.98,54.36 51.49,54.36 51.47,54.33 51.53,53.7
  pour Bottom (rank 3): 56.93,50.88 56.98,50.88 57.03,50.88 57.66,50.95 57.72,50.96 58.32,51.15 58.37,51.17 58.93,51.47 58.97,51.5 59.42,51.87 59.46,51.91 59.86,52.4 59.89,52.44 60.19,53 60.39,53.66 60.46,54.34 60.42,54.36 56.93,54.36 56.92,54.32 56.92,50.88
  pour Bottom (rank 3): 51.46,73.7 51.46,71.09 51.5,70.93 54.91,70.93 55.01,71.03 55.01,73.64 54.87,73.7
  pour Bottom (rank 3): 56.92,73.7 56.92,71.09 56.95,70.93 60.36,70.93 60.46,71.03 60.46,73.64 60.33,73.7
  pour Bottom (rank 3): 66.81,71.54 66.81,68.93 66.85,68.77 70.26,68.77 70.36,68.87 70.36,71.47 70.22,71.54
  pour Bottom (rank 3): 72.27,71.54 72.27,68.93 72.3,68.77 75.71,68.77 75.81,68.87 75.81,71.47 75.68,71.54
  pour Bottom (rank 3): 82.16,69.39 82.16,66.79 82.2,66.62 85.61,66.62 85.71,66.72 85.71,69.33 85.57,69.39
  pour Bottom (rank 3): 87.62,69.39 87.62,66.79 87.65,66.62 91.06,66.62 91.16,66.72 91.16,69.33 91.03,69.39
  pour Bottom (rank 3): 32.97,86.5 35.56,86.5 35.75,86.52 35.75,88.31 35.65,88.41 33.06,88.41 32.97,88.3
  pour Bottom (rank 3): 32.97,82.69 35.56,82.69 35.75,82.7 35.75,84.5 35.65,84.6 33.06,84.6 32.97,84.48
  pour Bottom (rank 3): 32.97,66.45 35.56,66.45 35.75,66.47 35.75,68.26 35.65,68.36 33.06,68.36 32.97,68.24
  pour Bottom (rank 3): 32.97,70.27 35.56,70.27 35.75,70.28 35.75,72.08 35.65,72.18 33.06,72.18 32.97,72.06
  pour Bottom (rank 3): 32.97,54.03 35.56,54.03 35.75,54.05 35.75,55.84 35.65,55.94 33.06,55.94 32.97,55.82
  pour Bottom (rank 3): 32.97,50.21 35.56,50.21 35.75,50.23 35.75,52.02 35.65,52.12 33.06,52.12 32.97,52.01
  pour Bottom (rank 3): 35.63,32.34 38.22,32.34 38.4,32.36 38.4,34.15 38.3,34.25 35.71,34.25 35.63,34.13
  pour Bottom (rank 3): 35.63,28.53 38.22,28.53 38.4,28.54 38.4,30.34 38.3,30.44 35.71,30.44 35.63,30.32
  pour Bottom (rank 3): 135.94,32.34 138.53,32.34 138.71,32.36 138.71,34.15 138.61,34.25 136.02,34.25 135.94,34.13
  pour Bottom (rank 3): 135.94,28.53 138.53,28.53 138.71,28.54 138.71,30.34 138.61,30.44 136.02,30.44 135.94,30.32
  pour Bottom (rank 3): 180.47,110.13 183.05,110.13 183.24,110.15 183.24,111.94 183.14,112.04 180.55,112.04 180.47,111.92
  pour Bottom (rank 3): 180.47,106.31 183.05,106.31 183.24,106.33 183.24,108.12 183.14,108.22 180.55,108.22 180.47,108.1
  pour Bottom (rank 3): 177.51,30.75 180.1,30.75 180.28,30.77 180.28,32.56 180.18,32.66 177.6,32.66 177.51,32.55
  pour Bottom (rank 3): 177.51,26.94 180.1,26.94 180.28,26.96 180.28,28.75 180.18,28.85 177.6,28.85 177.51,28.73
  pour Bottom (rank 3): 108.02,32.34 110.61,32.34 110.79,32.36 110.79,34.15 110.69,34.25 108.1,34.25 108.02,34.13
  pour Bottom (rank 3): 108.02,28.53 110.61,28.53 110.79,28.54 110.79,30.34 110.69,30.44 108.1,30.44 108.02,30.32
  pour Bottom (rank 3): 118.15,105.47 118.15,102.88 118.17,102.7 119.96,102.7 120.06,102.8 120.06,105.39 119.94,105.47
  pour Bottom (rank 3): 114.33,105.47 114.33,102.88 114.35,102.7 116.14,102.7 116.24,102.8 116.24,105.39 116.13,105.47
  pour Bottom (rank 3): 83.95,105.47 83.95,102.88 83.96,102.7 85.76,102.7 85.86,102.8 85.86,105.39 85.74,105.47
  pour Bottom (rank 3): 80.13,105.47 80.13,102.88 80.15,102.7 81.94,102.7 82.04,102.8 82.04,105.39 81.92,105.47
  pour Bottom (rank 3): 45.93,105.47 45.93,102.88 45.94,102.7 47.74,102.7 47.84,102.8 47.84,105.39 47.72,105.47
  pour Bottom (rank 3): 49.74,105.47 49.74,102.88 49.76,102.7 51.55,102.7 51.65,102.8 51.65,105.39 51.54,105.47
  pour Bottom (rank 3): 135.94,102.61 138.53,102.61 138.71,102.63 138.71,104.42 138.61,104.52 136.02,104.52 135.94,104.4
  pour Bottom (rank 3): 35.63,102.61 38.22,102.61 38.4,102.63 38.4,104.42 38.3,104.52 35.71,104.52 35.63,104.4
  pour Bottom (rank 3): 135.94,106.42 138.53,106.42 138.71,106.44 138.71,108.23 138.61,108.33 136.02,108.33 135.94,108.22
  cutout Top (rank 3): 137.16,111.76 147.32,111.76 149.86,111.76 149.86,106.68 139.7,106.68 139.7,109.22 137.16,109.22
  cutout Bottom (rank 3): 137.16,111.76 149.86,111.76 149.86,106.68 139.7,106.68 139.7,109.22 137.16,109.22
N$1
  Top 0.203: S1.2 41.95,76.2 29.21,76.2 29.21,87.63 41.91,100.33 R2.P$2
N$2
  Top 0.203: S1.1 41.95,78.74 30.48,78.74 30.48,87.63 39.37,96.52 R1.P$2
N$3
  Top 0.203: R1.P$1 87.63,96.52 91.44,92.71 119.38,92.71 128.27,101.6 J1.1
N$4
  Top 0.203: J2.1 142.37,109.22 141.48,110.11 132.97,110.11 118.11,95.25 105.41,95.25 100.33,100.33 BT1.NEGATIVE
N$5  (3 unrouted)
  Top 0.203: R2.P$1 87.63,100.33 88.9,101.6 88.9,106.81 BT1.POSITIVE@4

### Text on the board
Top: www.greatbigfactory.com | nickpoole.me